# Altium schematic sheet rectidiers.SchDoc
size A4
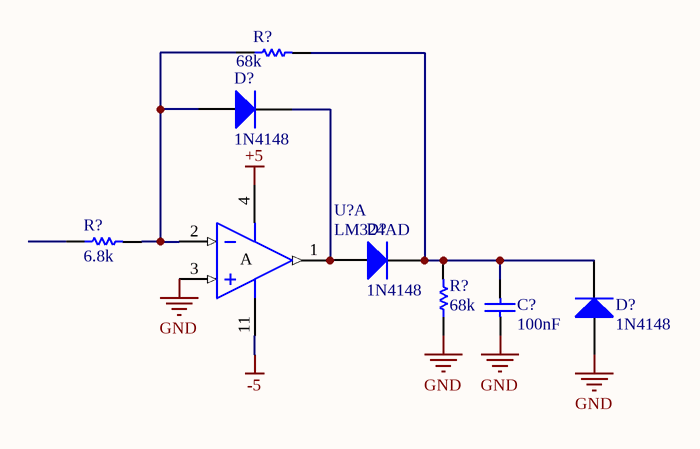
[diagram p0: rectidiers.SchDoc]

## Parts
(Parts that share a designator on the sheet are numbered #1, #2 ... from top to bottom, then left to right.)
C?  value 100nF  [SMD_CAP_0805]  (hidden comment: Cap)
D?#1  1N4148  [LL4148]
D?#2  1N4148  [LL4148]
D?#3  1N4148  [LL4148]
R?#1  value 68k  [RES 0805 (2012X06L)]  (hidden comment: Res1)
R?#2  value 6.8k  [RES 0805 (2012X06L)]  (hidden comment: Res1)
R?#3  value 68k  [RES 0805 (2012X06L)]  (hidden comment: Res1)
U?  LM324AD  [SO14_N]  (part A of 4)

## Nets
+5: U?.4(V+)
-5: U?.11(V-)
GND: C?.1 D?#3.1(A) R?#3.1 U?.3(IN+)
NetC?_2: C?.2 D?#2.2(K) D?#3.2(K) R?#1.2 R?#3.2
NetD?#1_1: D?#1.1(A) R?#1.1 R?#2.2 U?.2(IN-)
NetD?#1_2: D?#1.2(K) D?#2.1(A) U?.1(OUT)

Not connected (* = marked no-connect by the designer): R?#2 1

## Notes on the sheet
- (in symbol LM324AD, part A) A

## Library data of the parts
C? = Cap ceramic: CAP-100Nf
D?#1-D?#3 = Diode 1N4148: High Conductance Fast Diode; Published: 8-Jun-2000; LatestRevisionDate: 17-Jul-2002; LatestRevisionNote: Re-released for DXP Platform.; DatasheetVersion: 1997; PackageReference: DO-35; Publisher: Altium Limited; PackageDescription: Diode, Axial; Body 3.8 x 1.9 mm (LxDia. max), Lead Dia. 0.53 mm (max); Code_JEDEC: DO-204-AH; ComponentLink1Description: Manufacturer Link; ComponentLink1URL: http://www.fairchildsemi.com/; ComponentLink2Description: Datasheet; ComponentLink2URL: http://www.fairchildsemi.com/ds/1N%2F1N4148.pdf
R?#1-R?#3 = Res1: Resistor; Published: 8-Jun-2000; LatestRevisionDate: 17-Jul-2002; LatestRevisionNote: Re-released for DXP Platform.; PackageReference: AXIAL-0.3; Publisher: Altium Limited; PackageDescription: Axial Device, Thru-Hole; 2 Leads; 0.3 in Pin Spacing
U? = LM324AD: Low-Power Quad Operational Amplifier; Published: 24-Aug-2001; LatestRevisionDate: 13-Apr-2006; LatestRevisionNote: IPC-7351 Footprint Added.; DatasheetVersion: Nov-1997; PackageVersion: Sep-1998; PackageReference: SO14; Publisher: Altium Limited; PackageDescription: 14-Pin Small Outline Integrated Circuit 1.27 mm Pitch; Code_IPC: SOIC127P600-14; ComponentLink1Description: Manufacturer Link; ComponentLink1URL: http://www.st.com/; ComponentLink2Description: Datasheet; ComponentLink2URL: http://www.st.com/stonline/products/literature/ds/4797/lm224a.pdf